# Altium schematic sheet Sheet_1.schdoc
size 250 x 148 mm
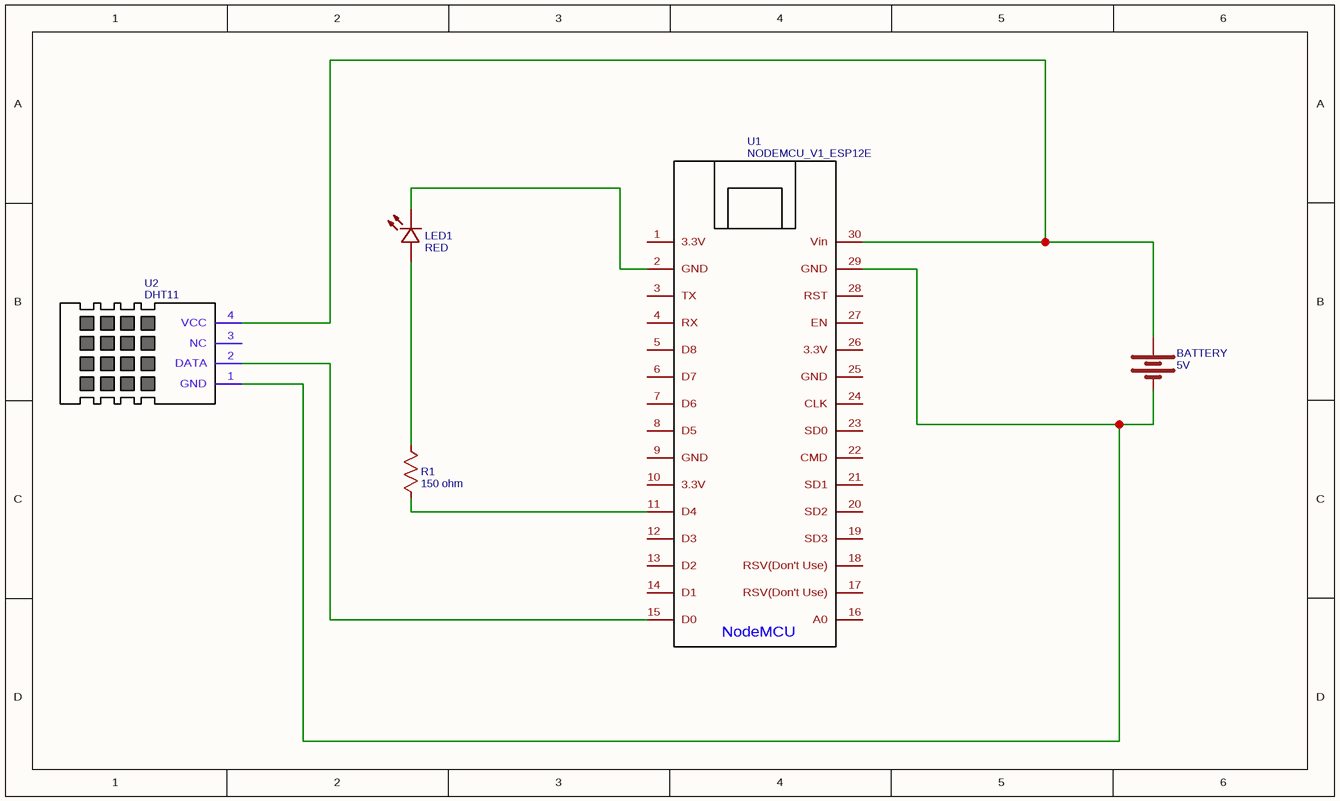
[diagram p0: Sheet_1.schdoc]

## Parts
5V  BATTERY  [BATTERY-AAA]
LED1  RED  [LED-3MM/2.54]
R1  150 ohm  [AXIAL-0.3]
U1  NODEMCU_V1_ESP12E  [NODEMCU_V3_ESP12E]
U2  DHT11  [DHT22_AM2303_VERT]

## Nets
Net5V_GND@1: 5V.GND@1(-) U1.29(GND) U2.1(GND)
Net5V_PWR@1: 5V.PWR@1(+) U1.30(Vin) U2.4(VCC)
NetLED1_1: LED1.1(A) R1.1
NetLED1_2: LED1.2(K) U1.2(GND)
NetR1_2: R1.2 U1.11(D4)
NetU1_15: U1.15(D0) U2.2(DATA)

Not connected (* = marked no-connect by the designer): U1 1(3.3V) 3(TX) 4(RX) 5(D8) 6(D7) 7(D6) 8(D5) 9(GND) 10(3.3V) 12(D3) 13(D2) 14(D1) 16(A0) 17(RSV(Don't_Use)) 18(RSV(Don't_Use)) 19(SD3) 20(SD2) 21(SD1) 22(CMD) 23(SD0) 24(CLK) 25(GND) 26(3.3V) 27(EN) 28(RST); U2 3(NC)

## Notes on the sheet
- (in symbol NODEMCU_V1_ESP12E) NodeMCU

## Library data of the parts
5V = BATTERY: Contributor: SparkFun; spicePre: B; spiceSymbolName: BATTERY
LED1 = RED: BOM_Manufacturer: EVERLIGHT; BOM_Manufacturer Part: 204-10SURD/S530-A3; BOM_Supplier: LCSC; BOM_Supplier Part: C99772; spicePre: L; spiceSymbolName: 204-10SURD/S530-A3
R1 = 150 ohm: nameAlias: Value(Ω); spicePre: R; spiceSymbolName: Res_AXIAL-0.3(1/8W)_US
U1 = NODEMCU_V1_ESP12E: nameAlias: Model; Contributor: jhro1004; sourceId: OGtr1ZXUS; spicePre: X; timeStamp: 1458805415; spiceSymbolName: NODEMCU_V1_ESP12E
U2 = DHT11: BOM_Manufacturer: Aosong (Guangzhou) Electronics Co., Ltd.; sourceId: GkiDrp9vf; BOM_Voltage: 3.3V - 5.5V; BOM_Mounted: Yes; BOM_Description: Digital-output relative humidity & temperature sensor/module; timeStamp: 1469804316; BOM_Supplier Part: PRODUCT ID: 385; BOM_Supplier: AdaFruit; link: https://cdn-shop.adafruit.com/datasheets/DHT22.pdf; spicePre: U; spiceSymbolName: DHT22